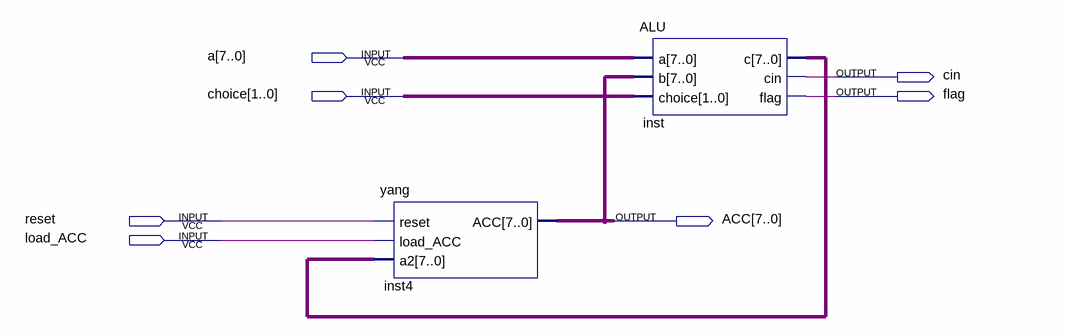
[diagram p0: schematic sheet]
// Quartus schematic Block1.bdf as structural Verilog: 2 symbols, 7 pins
module Block1 (
  input  [7:0] a,
  input  [1:0] choice,
  input  reset,
  input  load_ACC,
  output cin,
  output flag,
  output [7:0] ACC
);

  wire [7:0] inst_c;

  yang inst4 (.reset(reset), .load_ACC(load_ACC), .a2(inst_c), .ACC(ACC));
  ALU inst (.a(a), .b(ACC), .choice(choice), .c(inst_c), .cin(cin), .flag(flag));
endmodule
